# Altium schematic sheet MCU.SchDoc
size A2
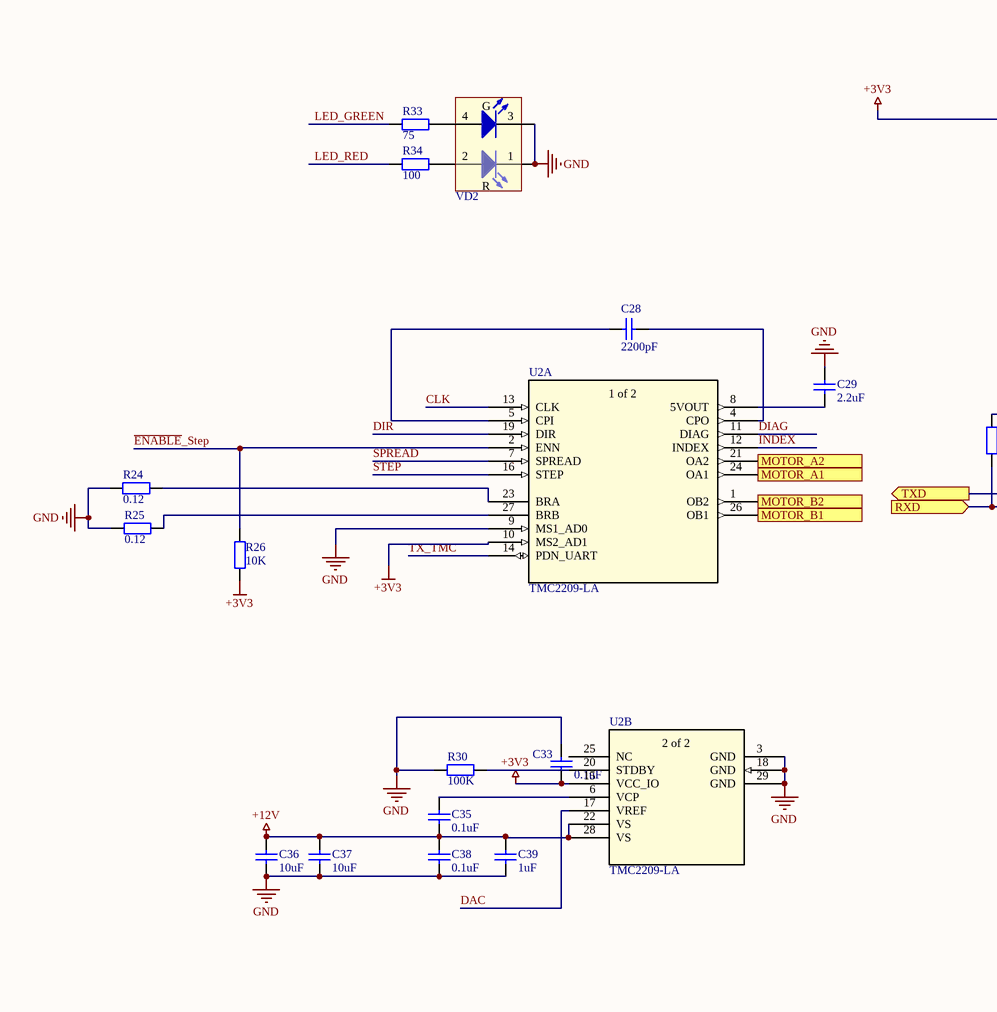
[diagram p0: MCU.SchDoc, left]
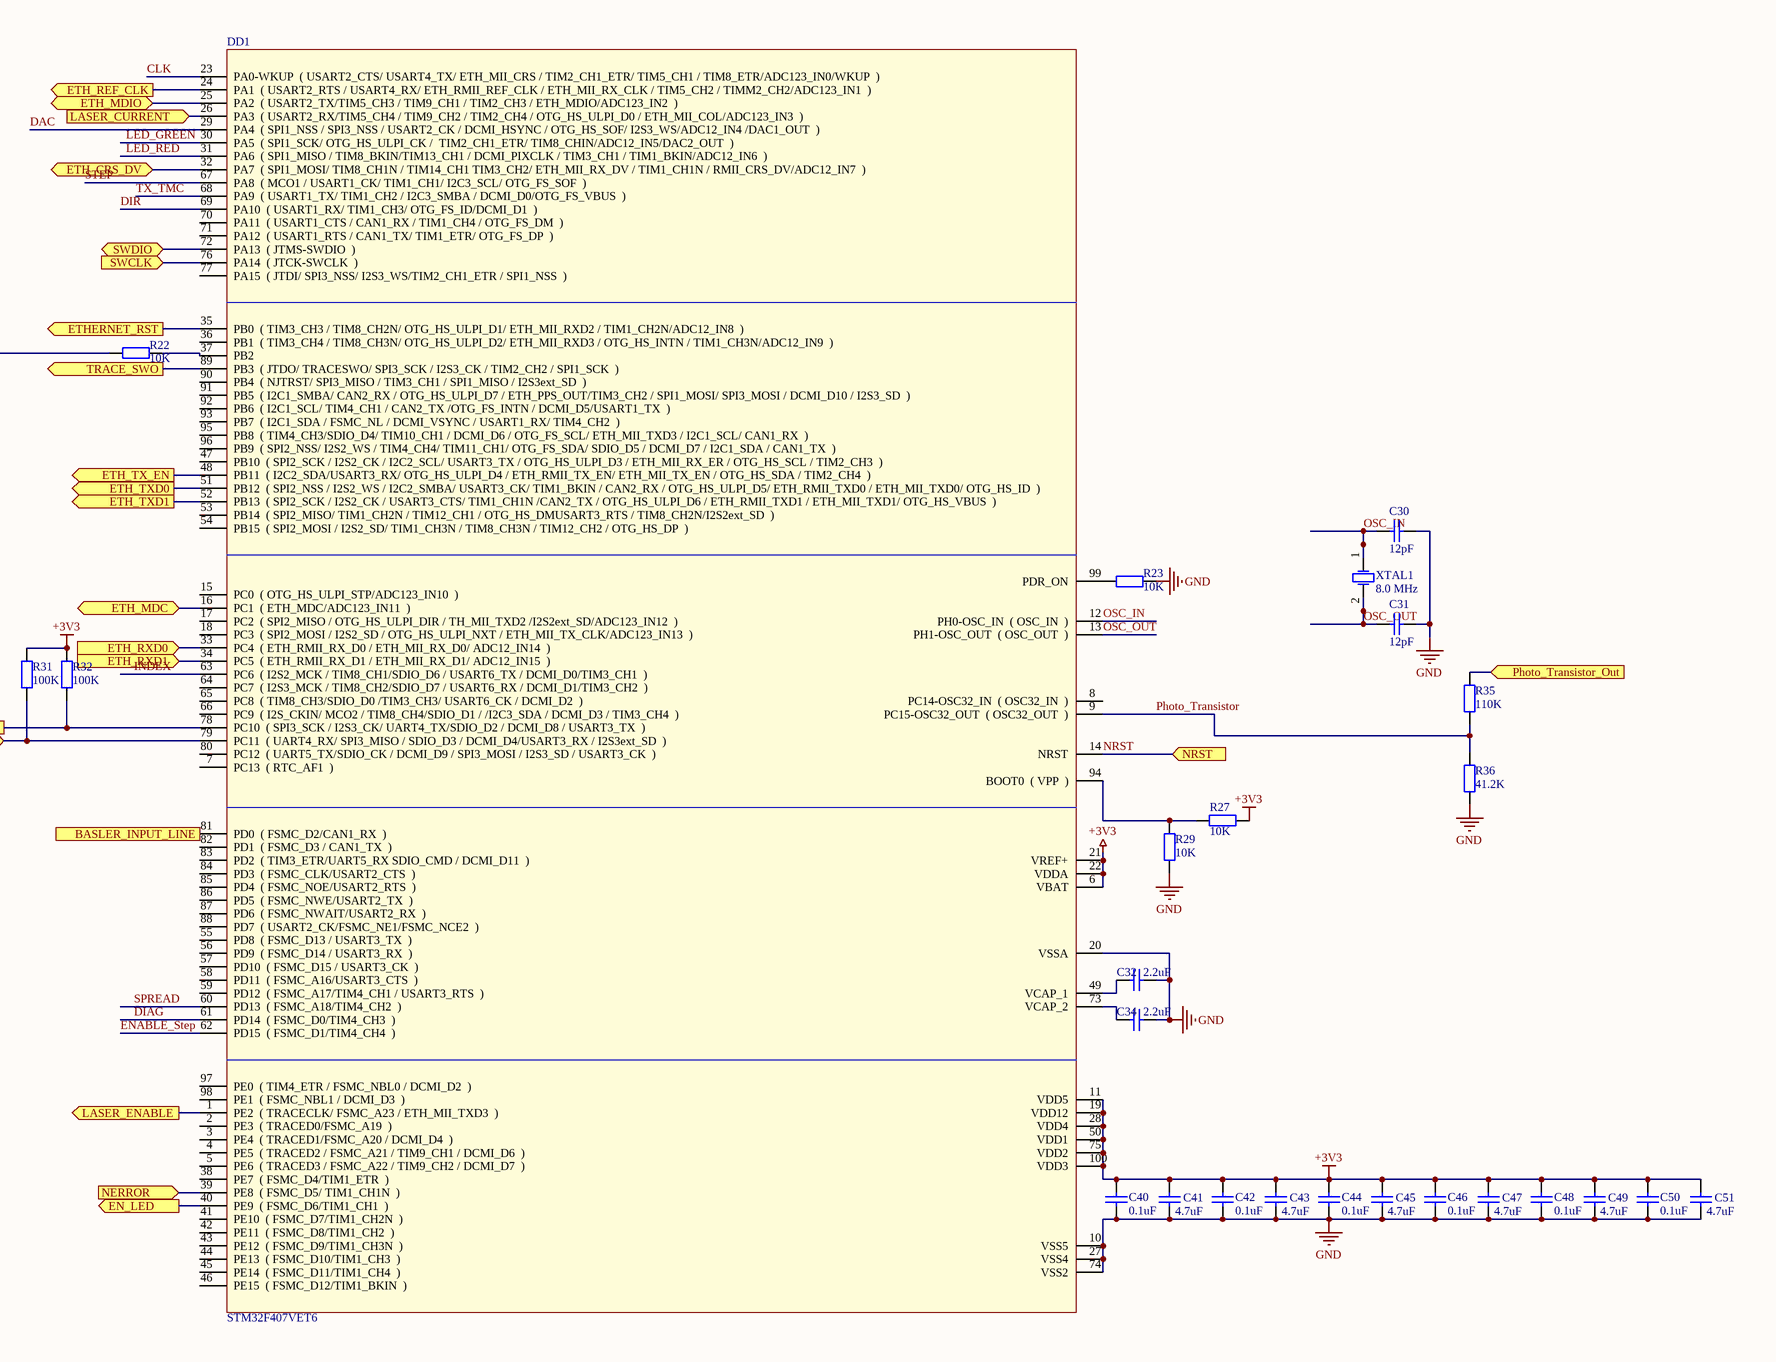
[diagram p1: MCU.SchDoc, right]

## Parts
C28  value 2200pF  [C0603]  (hidden comment: C0603-2200pF-50V-X7R)
C29  value 2.2uF  [C1206]  (hidden comment: C1206-2.2uF-25V-X5R)
C30  value 12pF  [C0603]  (hidden comment: C0603-12pF-50V-NP0)
C31  value 12pF  [C0603]  (hidden comment: C0603-12pF-50V-NP0)
C32  value 2.2uF  [C0805]  (hidden comment: C0805-2.2uF-16V-Y5V)
C33  value 0.1uF  [C0603]  (hidden comment: C0603-0.1uF-50V-X7R)
C34  value 2.2uF  [C0805]  (hidden comment: C0805-2.2uF-16V-Y5V)
C35  value 0.1uF  [C0603]  (hidden comment: C0603-0.1uF-50V-X7R)
C36  value 10uF  [C1210]  (hidden comment: C1210-10uF-50V-X7R)
C37  value 10uF  [C1210]  (hidden comment: C1210-10uF-50V-X7R)
C38  value 0.1uF  [C0603]  (hidden comment: C0603-0.1uF-50V-X7R)
C39  value 1uF  [C0603]  (hidden comment: C0603-1uF-50V-X5R)
C40  value 0.1uF  [C0603]  (hidden comment: C0603-0.1uF-50V-X7R)
C41  value 4.7uF  [C0603]  (hidden comment: C0603-4.7uF-16V-X5R)
C42  value 0.1uF  [C0603]  (hidden comment: C0603-0.1uF-50V-X7R)
C43  value 4.7uF  [C0603]  (hidden comment: C0603-4.7uF-16V-X5R)
C44  value 0.1uF  [C0603]  (hidden comment: C0603-0.1uF-50V-X7R)
C45  value 4.7uF  [C0603]  (hidden comment: C0603-4.7uF-16V-X5R)
C46  value 0.1uF  [C0603]  (hidden comment: C0603-0.1uF-50V-X7R)
C47  value 4.7uF  [C0603]  (hidden comment: C0603-4.7uF-16V-X5R)
C48  value 0.1uF  [C0603]  (hidden comment: C0603-0.1uF-50V-X7R)
C49  value 4.7uF  [C0603]  (hidden comment: C0603-4.7uF-16V-X5R)
C50  value 0.1uF  [C0603]  (hidden comment: C0603-0.1uF-50V-X7R)
C51  value 4.7uF  [C0603]  (hidden comment: C0603-4.7uF-16V-X5R)
DD1  STM32F407VET6  [LQFP100]
R22  value 10K  [R0603]  (hidden comment: R0603-10K-1%)
R23  value 10K  [R0603]  (hidden comment: R0603-10K-1%)
R24  value 0.12  [R1210]  (hidden comment: R1210-0.12-1%)
R25  value 0.12  [R1210]  (hidden comment: R1210-0.12-1%)
R26  value 10K  [R0603]  (hidden comment: R0603-10K-1%)
R27  value 10K  [R0603]  (hidden comment: R0603-10K-1%)
R29  value 10K  [R0603]  (hidden comment: R0603-10K-1%)
R30  value 100K  [R0603]  (hidden comment: R0603-100K-1%)
R31  value 100K  [R0603]  (hidden comment: R0603-100K-1%)
R32  value 100K  [R0603]  (hidden comment: R0603-100K-1%)
R33  value 75  [R0603]  (hidden comment: R0603-75-1%)
R34  value 100  [R0603]  (hidden comment: R0603-100-1%)
R35  value 110K  [R0603]  (hidden comment: R0603-110K-1%)
R36  value 41.2K  [R0603]  (hidden comment: R0603-41.2K-1%)
U2  TMC2209-LA  [QFN28]  (parts A,B of 2)
VD2  KAA-3528ESGC  [KAA-3528]  (value not drawn)
XTAL1  value 8.0 MHz  [ABM3]  (hidden comment: ABM3-8.000MHZ-D2Y-T)

## Ports
BASLER_INPUT_LINE (in), EN_LED (out), ETH_CRS_DV (bidir), ETH_MDC (bidir), ETH_MDIO (bidir), ETH_REF_CLK (out), ETH_RXD0 (in), ETH_RXD1 (in), ETH_TX_EN (out), ETH_TXD0 (out), ETH_TXD1 (out), ETHERNET_RST (out), LASER_CURRENT (in), LASER_ENABLE (out), MOTOR_A1 (out), MOTOR_A2 (out), MOTOR_B1 (out), MOTOR_B2 (out), NERROR (in), NRST (in), Photo_Transistor_Out (in), RXD (in), SWCLK (in), SWDIO (bidir), TRACE_SWO (out), TXD (out)

## Nets
+3V3: C33.1 C40.2 C41.2 C42.2 C43.2 C44.2 C45.2 C46.2 C47.2 C48.2 C49.2 C50.2 C51.2 DD1.6(VBAT) DD1.11(VDD5) DD1.19(VDD12) DD1.21(VREF+) DD1.22(VDDA) DD1.28(VDD4) DD1.50(VDD1) DD1.75(VDD2) DD1.100(VDD3) R22.1 R26.2 R27.2 R31.1 R32.1 U2.10(MS2_AD1) U2.15(VCC_IO)
+12V: C35.1 C36.2 C37.2 C38.2 C39.2 U2.22(VS) U2.28(VS)
GND: C29.1 C30.1 C31.1 C32.1 C33.2 C34.1 C36.1 C37.1 C38.1 C39.1 C40.1 C41.1 C42.1 C43.1 C44.1 C45.1 C46.1 C47.1 C48.1 C49.1 C50.1 C51.1 DD1.10(VSS5) DD1.20(VSSA) DD1.27(VSS4) DD1.74(VSS2) R23.2 R24.1 R25.1 R29.2 R30.1 R36.1 U2.3(GND) U2.9(MS1_AD0) U2.18(GND) U2.29(GND) VD2.1(K2) VD2.3(K1)
BASLER_INPUT_LINE: DD1.81(PD0__(_FSMC_D2/CAN1_RX__)) ; port BASLER_INPUT_LINE
CLK: DD1.23(PA0-WKUP__(_USART2_CTS/_USART4_TX/_ETH_MII_CRS_/_TIM2_CH1_ETR/_TIM5_CH1_/_TIM8_ETR/ADC123_IN0/WKUP__)) U2.13(CLK)
DAC: DD1.29(PA4__(_SPI1_NSS_/_SPI3_NSS_/_USART2_CK_/_DCMI_HSYNC_/_OTG_HS_SOF/_I2S3_WS/ADC12_IN4_/DAC1_OUT__)) U2.17(VREF)
DIAG: DD1.61(PD14__(_FSMC_D0/TIM4_CH3__)) U2.11(DIAG)
DIR: DD1.69(PA10__(_USART1_RX/_TIM1_CH3/_OTG_FS_ID/DCMI_D1__)) U2.19(DIR)
~{ENABLE}_Step: DD1.62(PD15__(_FSMC_D1/TIM4_CH4__)) R26.1 U2.2(ENN)
EN_LED: DD1.40(PE9__(_FSMC_D6/TIM1_CH1__)) ; port EN_LED
ETH_CRS_DV: DD1.32(PA7__(_SPI1_MOSI/_TIM8_CH1N_/_TIM14_CH1_TIM3_CH2/_ETH_MII_RX_DV_/_TIM1_CH1N_/_RMII_CRS_DV/ADC12_IN7__)) ; port ETH_CRS_DV
ETH_MDC: DD1.16(PC1__(_ETH_MDC/ADC123_IN11__)) ; port ETH_MDC
ETH_MDIO: DD1.25(PA2__(_USART2_TX/TIM5_CH3_/_TIM9_CH1_/_TIM2_CH3_/_ETH_MDIO/ADC123_IN2__)) ; port ETH_MDIO
ETH_REF_CLK: DD1.24(PA1__(_USART2_RTS_/_USART4_RX/_ETH_RMII_REF_CLK_/_ETH_MII_RX_CLK_/_TIM5_CH2_/_TIMM2_CH2/ADC123_IN1__)) ; port ETH_REF_CLK
ETH_RXD0: DD1.33(PC4__(_ETH_RMII_RX_D0_/_ETH_MII_RX_D0/_ADC12_IN14__)) ; port ETH_RXD0
ETH_RXD1: DD1.34(PC5__(_ETH_RMII_RX_D1_/_ETH_MII_RX_D1/_ADC12_IN15__)) ; port ETH_RXD1
ETH_TX_EN: DD1.48(PB11__(_I2C2_SDA/USART3_RX/_OTG_HS_ULPI_D4_/_ETH_RMII_TX_EN/_ETH_MII_TX_EN_/_OTG_HS_SDA_/_TIM2_CH4__)) ; port ETH_TX_EN
ETH_TXD0: DD1.51(PB12__(_SPI2_NSS_/_I2S2_WS_/_I2C2_SMBA/_USART3_CK/_TIM1_BKIN_/_CAN2_RX_/_OTG_HS_ULPI_D5/_ETH_RMII_TXD0_/_ETH_MII_TXD0/_OTG_HS_ID__)) ; port ETH_TXD0
ETH_TXD1: DD1.52(PB13__(_SPI2_SCK_/_I2S2_CK_/_USART3_CTS/_TIM1_CH1N_/CAN2_TX_/_OTG_HS_ULPI_D6_/_ETH_RMII_TXD1_/_ETH_MII_TXD1/_OTG_HS_VBUS__)) ; port ETH_TXD1
ETHERNET_RST: DD1.35(PB0__(_TIM3_CH3_/_TIM8_CH2N/_OTG_HS_ULPI_D1/_ETH_MII_RXD2_/_TIM1_CH2N/ADC12_IN8__)) ; port ETHERNET_RST
INDEX: DD1.63(PC6__(_I2S2_MCK_/_TIM8_CH1/SDIO_D6_/_USART6_TX_/_DCMI_D0/TIM3_CH1__)) U2.12(INDEX)
LASER_CURRENT: DD1.26(PA3__(_USART2_RX/TIM5_CH4_/_TIM9_CH2_/_TIM2_CH4_/_OTG_HS_ULPI_D0_/_ETH_MII_COL/ADC123_IN3__)) ; port LASER_CURRENT
LASER_ENABLE: DD1.1(PE2__(_TRACECLK/_FSMC_A23_/_ETH_MII_TXD3__)) ; port LASER_ENABLE
LED_GREEN: DD1.30(PA5__(_SPI1_SCK/_OTG_HS_ULPI_CK_/__TIM2_CH1_ETR/_TIM8_CHIN/ADC12_IN5/DAC2_OUT__)) R33.1
LED_RED: DD1.31(PA6__(_SPI1_MISO_/_TIM8_BKIN/TIM13_CH1_/_DCMI_PIXCLK_/_TIM3_CH1_/_TIM1_BKIN/ADC12_IN6__)) R34.1
MOTOR_A1: U2.24(OA1) ; port MOTOR_A1
MOTOR_A2: U2.21(OA2) ; port MOTOR_A2
MOTOR_B1: U2.26(OB1) ; port MOTOR_B1
MOTOR_B2: U2.1(OB2) ; port MOTOR_B2
NERROR: DD1.39(PE8__(_FSMC_D5/_TIM1_CH1N__)) ; port NERROR
NRST: DD1.14(NRST) ; port NRST
OSC_IN: C30.2 DD1.12(PH0-OSC_IN__(_OSC_IN__)) XTAL1.1(OSC1)
OSC_OUT: C31.2 DD1.13(PH1-OSC_OUT__(_OSC_OUT__)) XTAL1.2(OSC2)
Photo_Transistor: DD1.9(PC15-OSC32_OUT__(_OSC32_OUT__)) R35.1 R36.2
Photo_Transistor_Out: R35.2 ; port Photo_Transistor_Out
RXD: DD1.79(PC11__(_UART4_RX/_SPI3_MISO_/_SDIO_D3_/_DCMI_D4/USART3_RX_/_I2S3ext_SD__)) R31.2 ; port RXD
SPREAD: DD1.60(PD13__(_FSMC_A18/TIM4_CH2__)) U2.7(SPREAD)
STEP: DD1.67(PA8__(_MCO1_/_USART1_CK/_TIM1_CH1/_I2C3_SCL/_OTG_FS_SOF__)) U2.16(STEP)
SWCLK: DD1.76(PA14__(_JTCK-SWCLK__)) ; port SWCLK
SWDIO: DD1.72(PA13__(_JTMS-SWDIO__)) ; port SWDIO
TRACE_SWO: DD1.89(PB3__(_JTDO/_TRACESWO/_SPI3_SCK_/_I2S3_CK_/_TIM2_CH2_/_SPI1_SCK__)) ; port TRACE_SWO
TX_TMC: DD1.68(PA9__(_USART1_TX/_TIM1_CH2_/_I2C3_SMBA_/_DCMI_D0/OTG_FS_VBUS__)) U2.14(PDN_UART)
TXD: DD1.78(PC10__(_SPI3_SCK_/_I2S3_CK/_UART4_TX/SDIO_D2_/_DCMI_D8_/_USART3_TX__)) R32.2 ; port TXD
NetC28_1: C28.1 U2.5(CPI)
NetC28_2: C28.2 U2.4(CPO)
NetC29_2: C29.2 U2.8(5VOUT)
NetC32_2: C32.2 DD1.49(VCAP_1)
NetC34_2: C34.2 DD1.73(VCAP_2)
NetC35_2: C35.2 U2.6(VCP)
NetDD1_37: DD1.37(PB2) R22.2
NetDD1_94: DD1.94(BOOT0__(_VPP__)) R27.1 R29.1
NetDD1_99: DD1.99(PDR_ON) R23.1
NetR24_2: R24.2 U2.23(BRA)
NetR25_2: R25.2 U2.27(BRB)
NetR30_2: R30.2 U2.20(STDBY)
NetR33_2: R33.2 VD2.4(A1)
NetR34_2: R34.2 VD2.2(A2)

Not connected (* = marked no-connect by the designer): DD1 2(PE3__(_TRACED0/FSMC_A19__)) 3(PE4__(_TRACED1/FSMC_A20_/_DCMI_D4__)) 4(PE5__(_TRACED2_/_FSMC_A21_/_TIM9_CH1_/_DCMI_D6__)) 5(PE6__(_TRACED3_/_FSMC_A22_/_TIM9_CH2_/_DCMI_D7__)) 7(PC13__(_RTC_AF1__)) 8(PC14-OSC32_IN__(_OSC32_IN__)) 15(PC0__(_OTG_HS_ULPI_STP/ADC123_IN10__)) 17(PC2__(_SPI2_MISO_/_OTG_HS_ULPI_DIR_/_TH_MII_TXD2_/I2S2ext_SD/ADC123_IN12__)) 18(PC3__(_SPI2_MOSI_/_I2S2_SD_/_OTG_HS_ULPI_NXT_/_ETH_MII_TX_CLK/ADC123_IN13__)) 36(PB1__(_TIM3_CH4_/_TIM8_CH3N/_OTG_HS_ULPI_D2/_ETH_MII_RXD3_/_OTG_HS_INTN_/_TIM1_CH3N/ADC12_IN9__)) 38(PE7__(_FSMC_D4/TIM1_ETR__)) 41(PE10__(_FSMC_D7/TIM1_CH2N__)) 42(PE11__(_FSMC_D8/TIM1_CH2__)) 43(PE12__(_FSMC_D9/TIM1_CH3N__)) 44(PE13__(_FSMC_D10/TIM1_CH3__)) 45(PE14__(_FSMC_D11/TIM1_CH4__)) 46(PE15__(_FSMC_D12/TIM1_BKIN__)) 47(PB10__(_SPI2_SCK_/_I2S2_CK_/_I2C2_SCL/_USART3_TX_/_OTG_HS_ULPI_D3_/_ETH_MII_RX_ER_/_OTG_HS_SCL_/_TIM2_CH3__)) 53(PB14__(_SPI2_MISO/_TIM1_CH2N_/_TIM12_CH1_/_OTG_HS_DMUSART3_RTS_/_TIM8_CH2N/I2S2ext_SD__)) 54(PB15__(_SPI2_MOSI_/_I2S2_SD/_TIM1_CH3N_/_TIM8_CH3N_/_TIM12_CH2_/_OTG_HS_DP__)) 55(PD8__(_FSMC_D13_/_USART3_TX__)) 56(PD9__(_FSMC_D14_/_USART3_RX__)) 57(PD10__(_FSMC_D15_/_USART3_CK__)) 58(PD11__(_FSMC_A16/USART3_CTS__)) 59(PD12__(_FSMC_A17/TIM4_CH1_/_USART3_RTS__)) 64(PC7__(_I2S3_MCK_/_TIM8_CH2/SDIO_D7_/_USART6_RX_/_DCMI_D1/TIM3_CH2__)) 65(PC8__(_TIM8_CH3/SDIO_D0_/TIM3_CH3/_USART6_CK_/_DCMI_D2__)) 66(PC9__(_I2S_CKIN/_MCO2_/_TIM8_CH4/SDIO_D1_/_/I2C3_SDA_/_DCMI_D3_/_TIM3_CH4__)) 70(PA11__(_USART1_CTS_/_CAN1_RX_/_TIM1_CH4_/_OTG_FS_DM__)) 71(PA12__(_USART1_RTS_/_CAN1_TX/_TIM1_ETR/_OTG_FS_DP__)) 77(PA15__(_JTDI/_SPI3_NSS/_I2S3_WS/TIM2_CH1_ETR_/_SPI1_NSS__)) 80(PC12__(_UART5_TX/SDIO_CK_/_DCMI_D9_/_SPI3_MOSI_/_I2S3_SD_/_USART3_CK__)) 82(PD1__(_FSMC_D3_/_CAN1_TX__)) 83(PD2__(_TIM3_ETR/UART5_RX_SDIO_CMD_/_DCMI_D11__)) 84(PD3__(_FSMC_CLK/USART2_CTS__)) 85(PD4__(_FSMC_NOE/USART2_RTS__)) 86(PD5__(_FSMC_NWE/USART2_TX__)) 87(PD6__(_FSMC_NWAIT/USART2_RX__)) 88(PD7__(_USART2_CK/FSMC_NE1/FSMC_NCE2__)) 90(PB4__(_NJTRST/_SPI3_MISO_/_TIM3_CH1_/_SPI1_MISO_/_I2S3ext_SD__)) 91(PB5__(_I2C1_SMBA/_CAN2_RX_/_OTG_HS_ULPI_D7_/_ETH_PPS_OUT/TIM3_CH2_/_SPI1_MOSI/_SPI3_MOSI_/_DCMI_D10_/_I2S3_SD__)) 92(PB6__(_I2C1_SCL/_TIM4_CH1_/_CAN2_TX_/OTG_FS_INTN_/_DCMI_D5/USART1_TX__)) 93(PB7__(_I2C1_SDA_/_FSMC_NL_/_DCMI_VSYNC_/_USART1_RX/_TIM4_CH2__)) 95(PB8__(_TIM4_CH3/SDIO_D4/_TIM10_CH1_/_DCMI_D6_/_OTG_FS_SCL/_ETH_MII_TXD3_/_I2C1_SCL/_CAN1_RX__)) 96(PB9__(_SPI2_NSS/_I2S2_WS_/_TIM4_CH4/_TIM11_CH1/_OTG_FS_SDA/_SDIO_D5_/_DCMI_D7_/_I2C1_SDA_/_CAN1_TX__)) 97(PE0__(_TIM4_ETR_/_FSMC_NBL0_/_DCMI_D2__)) 98(PE1__(_FSMC_NBL1_/_DCMI_D3__)); U2 25(NC)

## Notes on the sheet
- (in symbol KAA-3528ESGC) G; R
- (in symbol TMC2209-LA, part A) 1 of 2
- (in symbol TMC2209-LA, part B) 2 of 2

## Library data of the parts
C28 = C0603-2200pF-50V-X7R: Ceramic Capacitor; Supplier 1: Digi-Key; Supplier Part Number 1: 445-1309-1-ND
C29 = C1206-2.2uF-25V-X5R: Ceramic Capacitor; Supplier 1: Digi-Key; Supplier Part Number 1: 445-4045-1-ND
C30 C31 = C0603-12pF-50V-NP0: Ceramic Capacitor; Supplier 1: Digi-Key; Supplier Part Number 1: 445-1270-1-ND
C32 C34 = C0805-2.2uF-16V-Y5V: Ceramic Capacitor; Supplier 1: Digi-Key; Supplier Part Number 1: 445-3464-1-ND
C33 C35 C38 C40 C42 C44 C46 C48 C50 = C0603-0.1uF-50V-X7R: Ceramic Capacitor; Supplier 1: Digi-Key; Supplier Part Number 1: 445-1324-1-ND
C36 C37 = C1210-10uF-50V-X7R: Ceramic Capacitor; Supplier 1: Digi-Key
C39 = C0603-1uF-50V-X5R: Ceramic Capacitor; Supplier 1: Digi-Key; Supplier Part Number 1: PCC2174TR-ND
C41 C43 C45 C47 C49 C51 = C0603-4.7uF-16V-X5R: Ceramic Capacitor; Supplier 1: Digi-Key; Supplier Part Number 1: 445-7478-1-ND
R22 R23 R26 R27 R29 = R0603-10K-1%: Chip Resistor; Supplier 1: Digi-Key; Supplier Part Number 1: P10.0KHCT-ND
R24 R25 = R1210-0.12-1%: Chip Resistor; Supplier 1: Digi-Key; Supplier Part Number 1: 311-0.12NATR-ND
R30-R32 = R0603-100K-1%: Chip Resistor; Supplier 1: Digi-Key; Supplier Part Number 1: P100KHCT-ND
R33 = R0603-75-1%: Chip Resistor; Supplier 1: Digi-Key; Supplier Part Number 1: P75.0HCT-ND
R34 = R0603-100-1%: Chip Resistor; Supplier 1: Digi-Key; Supplier Part Number 1: P100HCT-ND
R35 = R0603-110K-1%: Chip Resistor
R36 = R0603-41.2K-1%: Chip Resistor; Supplier 1: Digi-Key; Supplier Part Number 1: P41.2KHCT-ND
U2 = TMC2209-LA: Ultra-silent motor driver IC for two phase stepper motors.; SourceLibrary: Add_to_database_2020-10-29; Built_By: EMA_Cory; Vendor: Trinamic; Datasheet: https://www.trinamic.com/products/integrated-circuits/details/tmc2209-la/; Copyright: Copyright (C) 2018 Accelerated Designs. All rights reserved; Manufacturer_Part_Number: TMC2209-LA; RefDes: RefDes; Type: DEV
VD2 = KAA-3528ESGC: High red, super green; Red/green peak wave length: 627 nm/ 565 nm; Red/green peak current: 160 mA/ 140 mA; Red/green nominal current: 30 mA/ 25 mA; Red/green nominal voltage: 2,0 V/ 2,2 V; Red/green max voltage: 2,5 V; HelpUrl: \\Storage\Volume_2\SPEKTR-AT\Catalogs\Kingbright\KAA-3528ESGC.pdf
XTAL1 = ABM3-8.000MHZ-D2Y-T: Quartz; Supplier Part Number 1: 535-10630-2-ND; Supplier 1: Digi-Key; HelpUrl: https://abracon.com/Resonators/abm3.pdf